# EAGLE design bigSevenV3 (EAGLE 6.4)
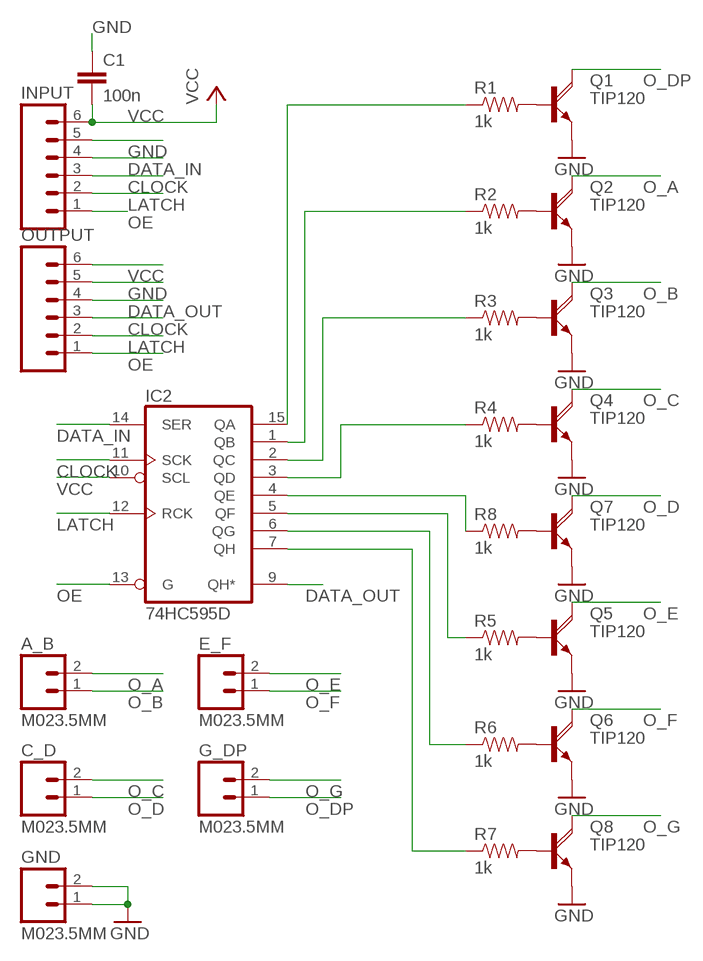
[diagram p0: schematic, sheet 1]

## Parts
A_B  M023.5MM  [SCREWTERMINAL-3.5MM-2]
C1  100n  CAP0805  [0805]
C_D  M023.5MM  [SCREWTERMINAL-3.5MM-2]
E_F  M023.5MM  [SCREWTERMINAL-3.5MM-2]
G_DP  M023.5MM  [SCREWTERMINAL-3.5MM-2]
GND  M023.5MM  [SCREWTERMINAL-3.5MM-2]
IC2  74HC595D  [SO16]
INPUT  M06LOCK  [1X06_LOCK]
OUTPUT  M06LOCK  [1X06_LOCK]
Q1  TIP120  [TO220AH]
Q2  TIP120  [TO220AH]
Q3  TIP120  [TO220AH]
Q4  TIP120  [TO220AH]
Q5  TIP120  [TO220AH]
Q6  TIP120  [TO220AH]
Q7  TIP120  [TO220AH]
Q8  TIP120  [TO220AH]
R1  1k  RESISTOR0805-RES  [0805]
R2  1k  RESISTOR0805-RES  [0805]
R3  1k  RESISTOR0805-RES  [0805]
R4  1k  RESISTOR0805-RES  [0805]
R5  1k  RESISTOR0805-RES  [0805]
R6  1k  RESISTOR0805-RES  [0805]
R7  1k  RESISTOR0805-RES  [0805]
R8  1k  RESISTOR0805-RES  [0805]

## Nets
CLOCK: IC2.11(SCK) INPUT.3 OUTPUT.3
DATA_IN: IC2.14(SER) INPUT.4
DATA_OUT: IC2.9(QH*) OUTPUT.4
GND: C1.1 GND.1 GND.2 INPUT.5 OUTPUT.5 Q1.E Q2.E Q3.E Q4.E Q5.E Q6.E Q7.E Q8.E
LATCH: IC2.12(RCK) INPUT.2 OUTPUT.2
N$1: Q1.B R1.2
N$2: Q2.B R2.2
N$3: Q3.B R3.2
N$4: Q4.B R4.2
N$5: Q5.B R5.2
N$6: Q6.B R6.2
N$7: Q8.B R7.2
N$8: Q7.B R8.2
N$9: IC2.15(QA) R1.1
N$10: IC2.1(QB) R2.1
N$11: IC2.2(QC) R3.1
N$12: IC2.3(QD) R4.1
N$13: IC2.4(QE) R8.1
N$14: IC2.5(QF) R5.1
N$15: IC2.6(QG) R6.1
N$16: IC2.7(QH) R7.1
O_A: A_B.2 Q2.C
O_B: A_B.1 Q3.C
O_C: C_D.2 Q4.C
O_D: C_D.1 Q7.C
O_DP: G_DP.1 Q1.C
O_E: E_F.2 Q5.C
O_F: E_F.1 Q6.C
O_G: G_DP.2 Q8.C
OE: IC2.13(G) INPUT.1 OUTPUT.1
VCC [VCC]: C1.2 IC2.10(SCL) INPUT.6 OUTPUT.6

## Power pins joined to a net without a drawn wire
GND: IC2.8(GND)
VCC: IC2.16(VCC)

## Library data of the parts
A_B C_D E_F G_DP GND = SparkFun-Connectors:M02: Standard 2-pin 0.1" header. Use with - straight break away headers ( PRT-00116) - right angle break away headers (PRT-00553) - swiss pins (PRT-00743) - machine pins (PRT-00117) - female headers (PRT-00115) Molex polarized connector foot print use with: PRT-08233 with associated crimp pins and housings. 2.54_SCREWTERM for use with PRT-10571. 3.5mm Screw Terminal footprints for PRT-08084 5mm Screw Terminal footprints for use with PRT-08432
C1 = SparkFun-Capacitors:CAP: Capacitor Standard 0603 ceramic capacitor, and 0.1" leaded capacitor.
IC2 = 74xx-eu:74*595: 8-bit SHIFT REGISTER, output latch
INPUT OUTPUT = SparkFun-Connectors:M06: Header 6 Standard 6-pin 0.1" header. Use with straight break away headers (SKU : PRT-00116), right angle break away headers (PRT-00553), swiss pins (PRT-00743), machine pins (PRT-00117), and female headers (PRT-00115). Molex polarized connector foot print use with SKU : PRT-08094 with associated crimp pins and housings. NOTES ON THE VARIANTS LOCK and LOCK_LONGPADS... This footprint was designed to help hold the alignment of a through-hole component (i.e. 6-pin header) while soldering it into place. You may notice that each hole has been shifted either up or down by 0.005 of an inch from it's more standard position (which is a perfectly straight line). This slight alteration caused the pins (the squares in the middle) to touch the edges of the holes. Because they are alternating, it causes a "brace" to hold the component in place. 0.005 has proven to be the perfect amount of "off-center" position when using our standard breakaway headers. Although looks a little odd when you look at the bare footprint, once you have a header in there, the alteration is very hard to notice. Also,if you push a header all the way into place, it is covered up entirely on the bottom side. This idea of altering the position of holes to aid alignment will be further integrated into the Sparkfun Library for other footprints. It can help hold any component with 3 or more connection pins.
Q1-Q8 = transistor-power:TIP120: NPN DARLINGTON TRANSISTOR
R1-R8 = SparkFun-Passives:RESISTOR: Resistor Basic schematic elements and footprints for 0603, 1206, and PTH resistors.

## Net classes
1 VCC: width 0.813 mm

## Board
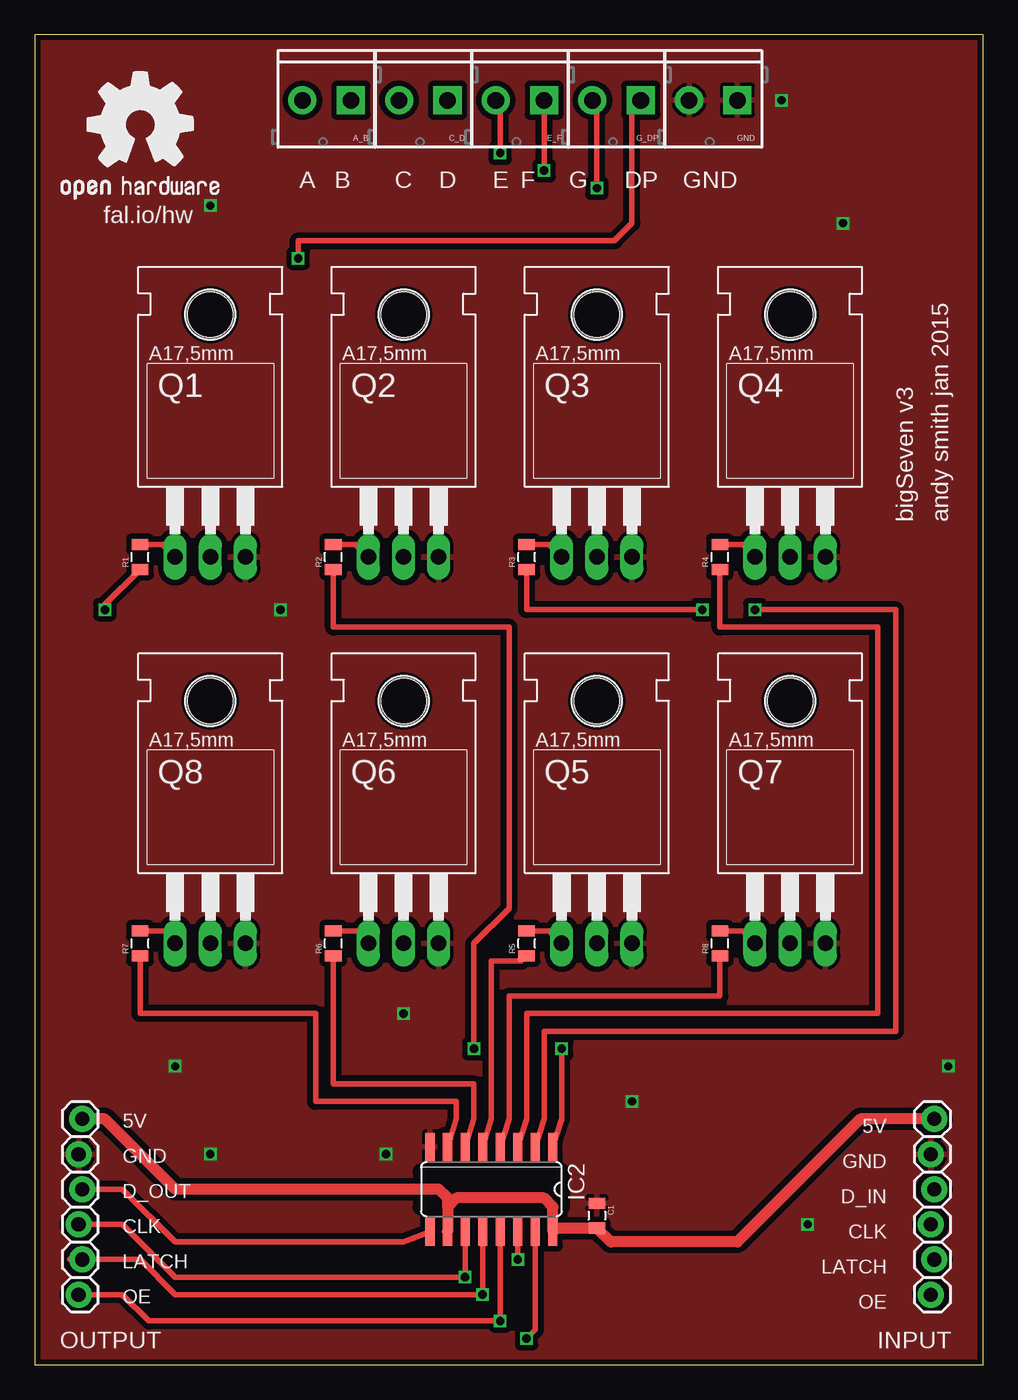
[diagram p1: board, top side]
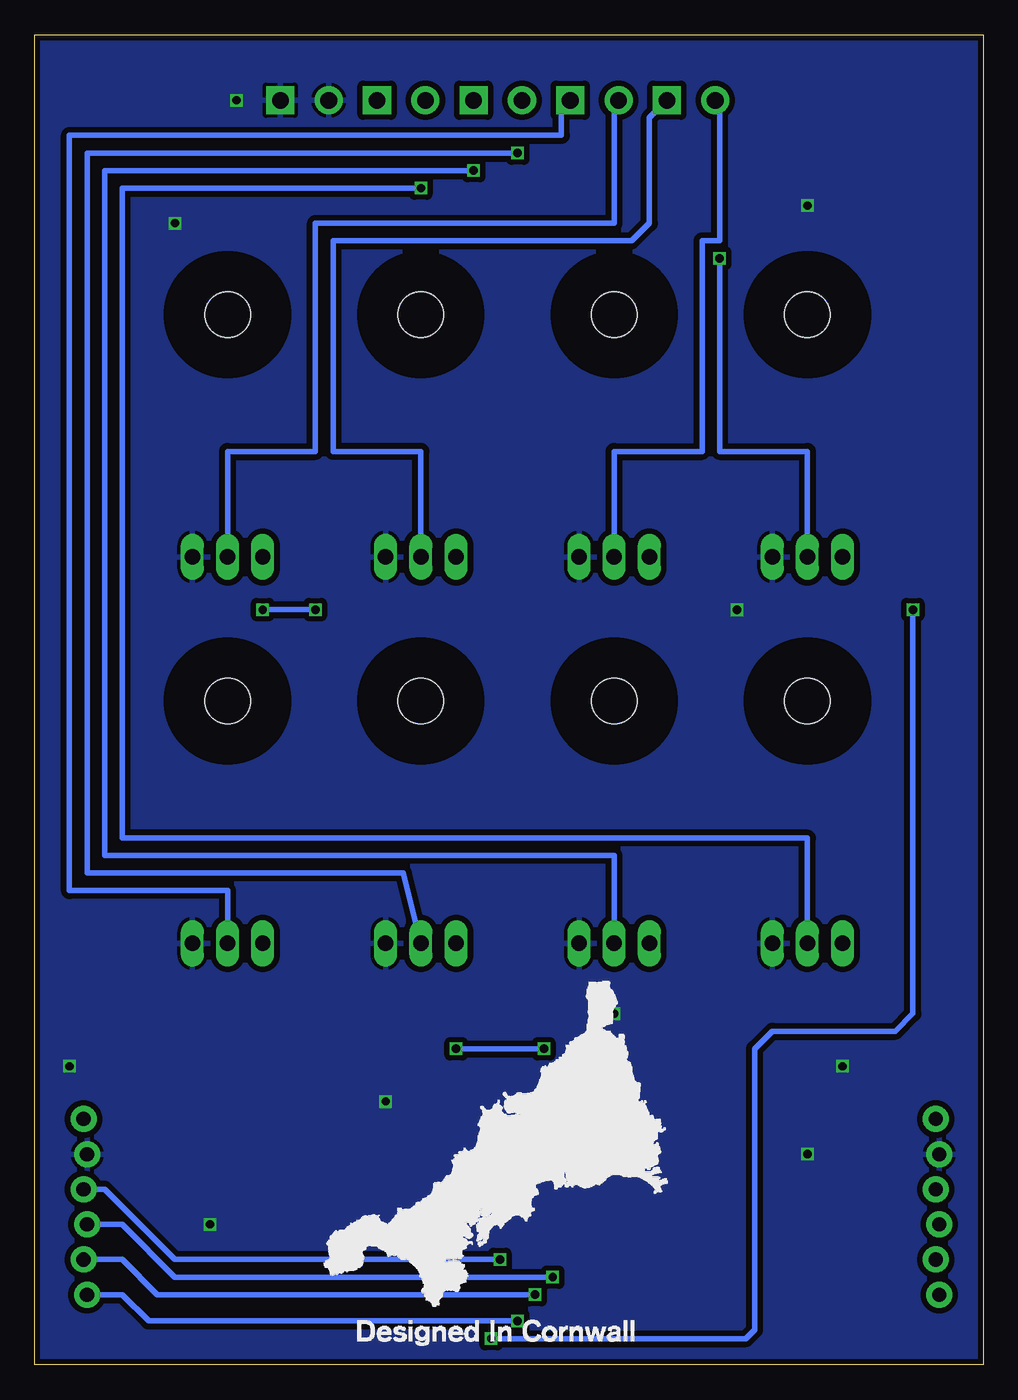
[diagram p2: board, bottom side, seen from below]

Size 68.56 x 96.19 mm. Coordinates in mm from the lower left corner, seen from the top.
Outline: 0,0 68.56,0 68.56,96.19 0,96.19 0,0
Copper layers (1*16): Top 0.035mm / dielectric 1.5mm / Bottom 0.035mm
Design rules "dirt_cheap_dirty_boards.v1": minimum track width 5mil, minimum drill 12mil, track to track 5mil, track to pad 5mil, pad to pad 5mil, via to via 5mil, smd to smd 0mil, copper to edge 10mil, drill to drill 10mil, minimum pad ring 10mil, minimum via ring 6mil, stop-mask expansion 2mil, vias tented up to drill 25mil, thermal gap 10mil
tRestrict: area 27.9,11.4 to 38.1,14

### Footprints (pad centres in the part's own frame; a part is rotated, then mirrored left to right if it is on the bottom)
SCREWTERMINAL-3.5MM-2 = drill 1.2 pad 2.032 square: 1 0,0 | drill 1.2 pad 2.032: 2 3.5,0
0805 = smd 0.8 x 1.2: 1 -0.9,0; 2 0.9,0
SO16 = smd 0.66 x 2.032: 1 -4.445,-3.073; 2 -3.175,-3.073; 3 -1.905,-3.073; 4 -0.635,-3.073; 5 0.635,-3.073; 6 1.905,-3.073; 7 3.175,-3.073; 8 4.445,-3.073; 9 4.445,3.073; 10 3.175,3.073; 11 1.905,3.073; 12 0.635,3.073; 13 -0.635,3.073; 14 -1.905,3.073; 15 -3.175,3.073; 16 -4.445,3.073
1X06_LOCK = drill 1.016 pad 1.88: 1 0,0; 2 2.54,-0.254; 3 5.08,0; 4 7.62,-0.254; 5 10.16,0; 6 12.7,-0.254
TO220AH = drill 1.118 long: B -2.54,-6.35; C 0,-6.35; E 2.54,-6.35 | hole 3.302: 0,11.176

### Placement (x,y rotation side)
A_B  22.86,91.44 180 top
C1  40.64,10.79 270 top
C_D  29.84,91.44 180 top
E_F  36.83,91.44 180 top
G_DP  43.81,91.44 180 top
GND  50.8,91.44 180 top
IC2  33.02,12.7 180 top
INPUT  64.77,5.08 90 top
OUTPUT  3.17,5.08 90 top
Q1  12.7,64.77 0 top
Q2  26.67,64.77 0 top
Q3  40.64,64.77 0 top
Q4  54.61,64.77 0 top
Q5  40.64,36.83 0 top
Q6  26.67,36.83 0 top
Q7  54.61,36.83 0 top
Q8  12.7,36.83 0 top
R1  7.62,58.42 90 top
R2  21.59,58.42 90 top
R3  35.56,58.42 90 top
R4  49.53,58.42 90 top
R5  35.56,30.48 90 top
R6  21.59,30.48 90 top
R7  7.62,30.48 90 top
R8  49.53,30.48 90 top
U$1  [OSHW1]  1.27,82.55 0 top
U$2  [CORNWALL_25MM]  47.62,1.27 0 bottom

### Tracks (layer width: path | path; a pad name or v marks a point on that pad's centre or on a via)
CLOCK  (via drill 0.6)
  Top 0.406: OUTPUT.3 6.35,10.16 10.16,6.35 v31.11,6.35 IC2.11
  Bottom 0.406: INPUT.3 62.23,10.16 58.42,6.35 v31.11,6.35
DATA_IN  (via drill 0.6)
  Top 0.406: v34.92,7.62 IC2.14
  Bottom 0.406: INPUT.4 63.5,12.7 58.42,7.62 v34.92,7.62
DATA_OUT
  Top 0.406: IC2.9 26.67,8.89 10.16,8.89 6.35,12.7 OUTPUT.4
GND  (via drill 0.6)
  other vias: 10.16,21.59 66.04,21.59 43.18,19.05 26.67,25.4 58.42,82.55 53.98,91.44 12.7,83.82 17.78,54.61 12.7,15.24 25.4,15.24 55.88,10.16
  pour Bottom (isolate 0.406): 0,97.79 0,0 68.58,0 68.58,97.79
  pour Top (isolate 0.406): 0,0 0,97.79 68.58,97.79 68.58,0
LATCH  (via drill 0.6)
  Top 0.406: 2.54,7.62 OUTPUT.2 7.62,7.62 10.16,5.08 v32.38,5.08 IC2.12
  Bottom 0.406: INPUT.2 62.23,7.62 59.69,5.08 v32.38,5.08
N$1
  Top 0.406: R1.2 9.26,59.32 Q1.B
N$2
  Top 0.406: R2.2 23.23,59.32 Q2.B
N$3
  Top 0.406: R3.2 37.2,59.32 Q3.B
N$4
  Top 0.406: R4.2 51.17,59.32 Q4.B
N$5
  Top 0.406: R5.2 37.2,31.38 Q5.B
N$6
  Top 0.406: R6.2 23.76,31.38 24.13,31.75 Q6.B
N$7
  Top 0.406: Q8.B 10.16,31.75 9.79,31.38 R7.2
N$8
  Top 0.406: R8.2 51.17,31.38 Q7.B
N$9  (via drill 0.6)
  Top 0.406: v5.08,54.61 5.08,54.98 R1.1 | IC2.15 36.2,2.54 v35.56,1.91
  Bottom 0.406: v5.08,54.61 5.08,25.4 6.35,24.13 15.24,24.13 16.51,22.86 16.51,2.54 17.14,1.91 v35.56,1.91
N$10  (via drill 0.6)
  Top 0.406: IC2.1 38.1,17.78 v38.1,22.86 | v31.75,22.86 31.75,30.48 34.29,33.02 34.29,53.34 21.59,53.34 R2.1
  Bottom 0.406: v38.1,22.86 v31.75,22.86
N$11  (via drill 0.6)
  Top 0.406: IC2.2 36.83,17.78 36.83,24.13 62.23,24.13 62.23,54.61 v52.07,54.61 | v48.26,54.61 35.56,54.61 R3.1
  Bottom 0.406: v52.07,54.61 v48.26,54.61
N$12
  Top 0.406: IC2.3 35.56,17.78 35.56,25.4 60.96,25.4 60.96,53.34 49.53,53.34 R4.1
N$13
  Top 0.406: IC2.4 34.29,17.78 34.29,26.67 49.53,26.67 R8.1
N$14
  Top 0.406: IC2.5 33.02,17.78 33.02,29.21 35.19,29.21 R5.1
N$15
  Top 0.406: IC2.6 31.75,17.78 31.75,20.32 21.59,20.32 R6.1
N$16
  Top 0.406: IC2.7 30.48,17.78 30.48,19.05 20.32,19.05 20.32,25.4 7.62,25.4 R7.1
O_A
  Bottom 0.406: Q2.C 26.67,66.04 20.32,66.04 20.32,81.28 19.05,81.28 19.05,91.13 A_B.2
O_B
  Bottom 0.406: Q3.C 40.64,66.04 46.99,66.04 46.99,81.28 25.4,81.28 24.13,82.55 24.13,90.17 A_B.1
O_C
  Bottom 0.406: Q4.C 54.61,66.04 48.26,66.04 48.26,82.55 26.67,82.55 26.67,91.11 C_D.2
O_D
  Bottom 0.406: Q7.C 54.61,34.29 66.04,34.29 66.04,88.9 30.48,88.9 30.48,90.81 C_D.1
O_DP  (via drill 0.6)
  Top 0.406: v19.05,80.01 19.05,81.28 41.91,81.28 43.18,82.55 43.18,90.81 G_DP.1
  Bottom 0.406: v19.05,80.01 19.05,66.04 12.7,66.04 Q1.C
O_E  (via drill 0.6)
  Top 0.406: v33.66,87.63 33.66,91.11 E_F.2
  Bottom 0.406: Q5.C 41.91,35.56 64.77,35.56 64.77,87.63 v33.66,87.63
O_F  (via drill 0.6)
  Top 0.406: v36.83,86.36 E_F.1
  Bottom 0.406: Q6.C 26.67,36.83 63.5,36.83 63.5,86.36 v36.83,86.36
O_G  (via drill 0.6)
  Top 0.406: v40.64,85.09 40.64,91.11 G_DP.2
  Bottom 0.406: Q8.C 12.7,38.1 62.23,38.1 62.23,85.09 v40.64,85.09
OE  (via drill 0.6)
  Top 0.406: OUTPUT.1 6.35,5.08 8.26,3.17 v33.66,3.17 IC2.13
  Bottom 0.406: INPUT.1 62.23,5.08 60.33,3.17 v33.66,3.17
VCC
  Top 0.406: 40.64,9.63 C1.2
  Top 0.813: INPUT.6 59.69,17.78 50.8,8.89 41.65,8.89 C1.2 37.73,9.89 IC2.16 37.47,11.43 36.83,12.06 30.48,12.06 29.84,11.43 | 29.84,11.43 IC2.10 | 29.84,11.43 29.84,12.06 29.21,12.7 10.16,12.7 5.08,17.78 OUTPUT.6

### Text on the board
tPlace: A | B | C | D | E | F | G | DP | GND | fal.io/hw | bigSeven v3 | andy smith jan 2015 | 5V | 5V | GND | GND | D_IN | D_OUT | CLK | CLK | LATCH | LATCH | OE | OE